# Altium project INDACT_baseboard.PrjPcb
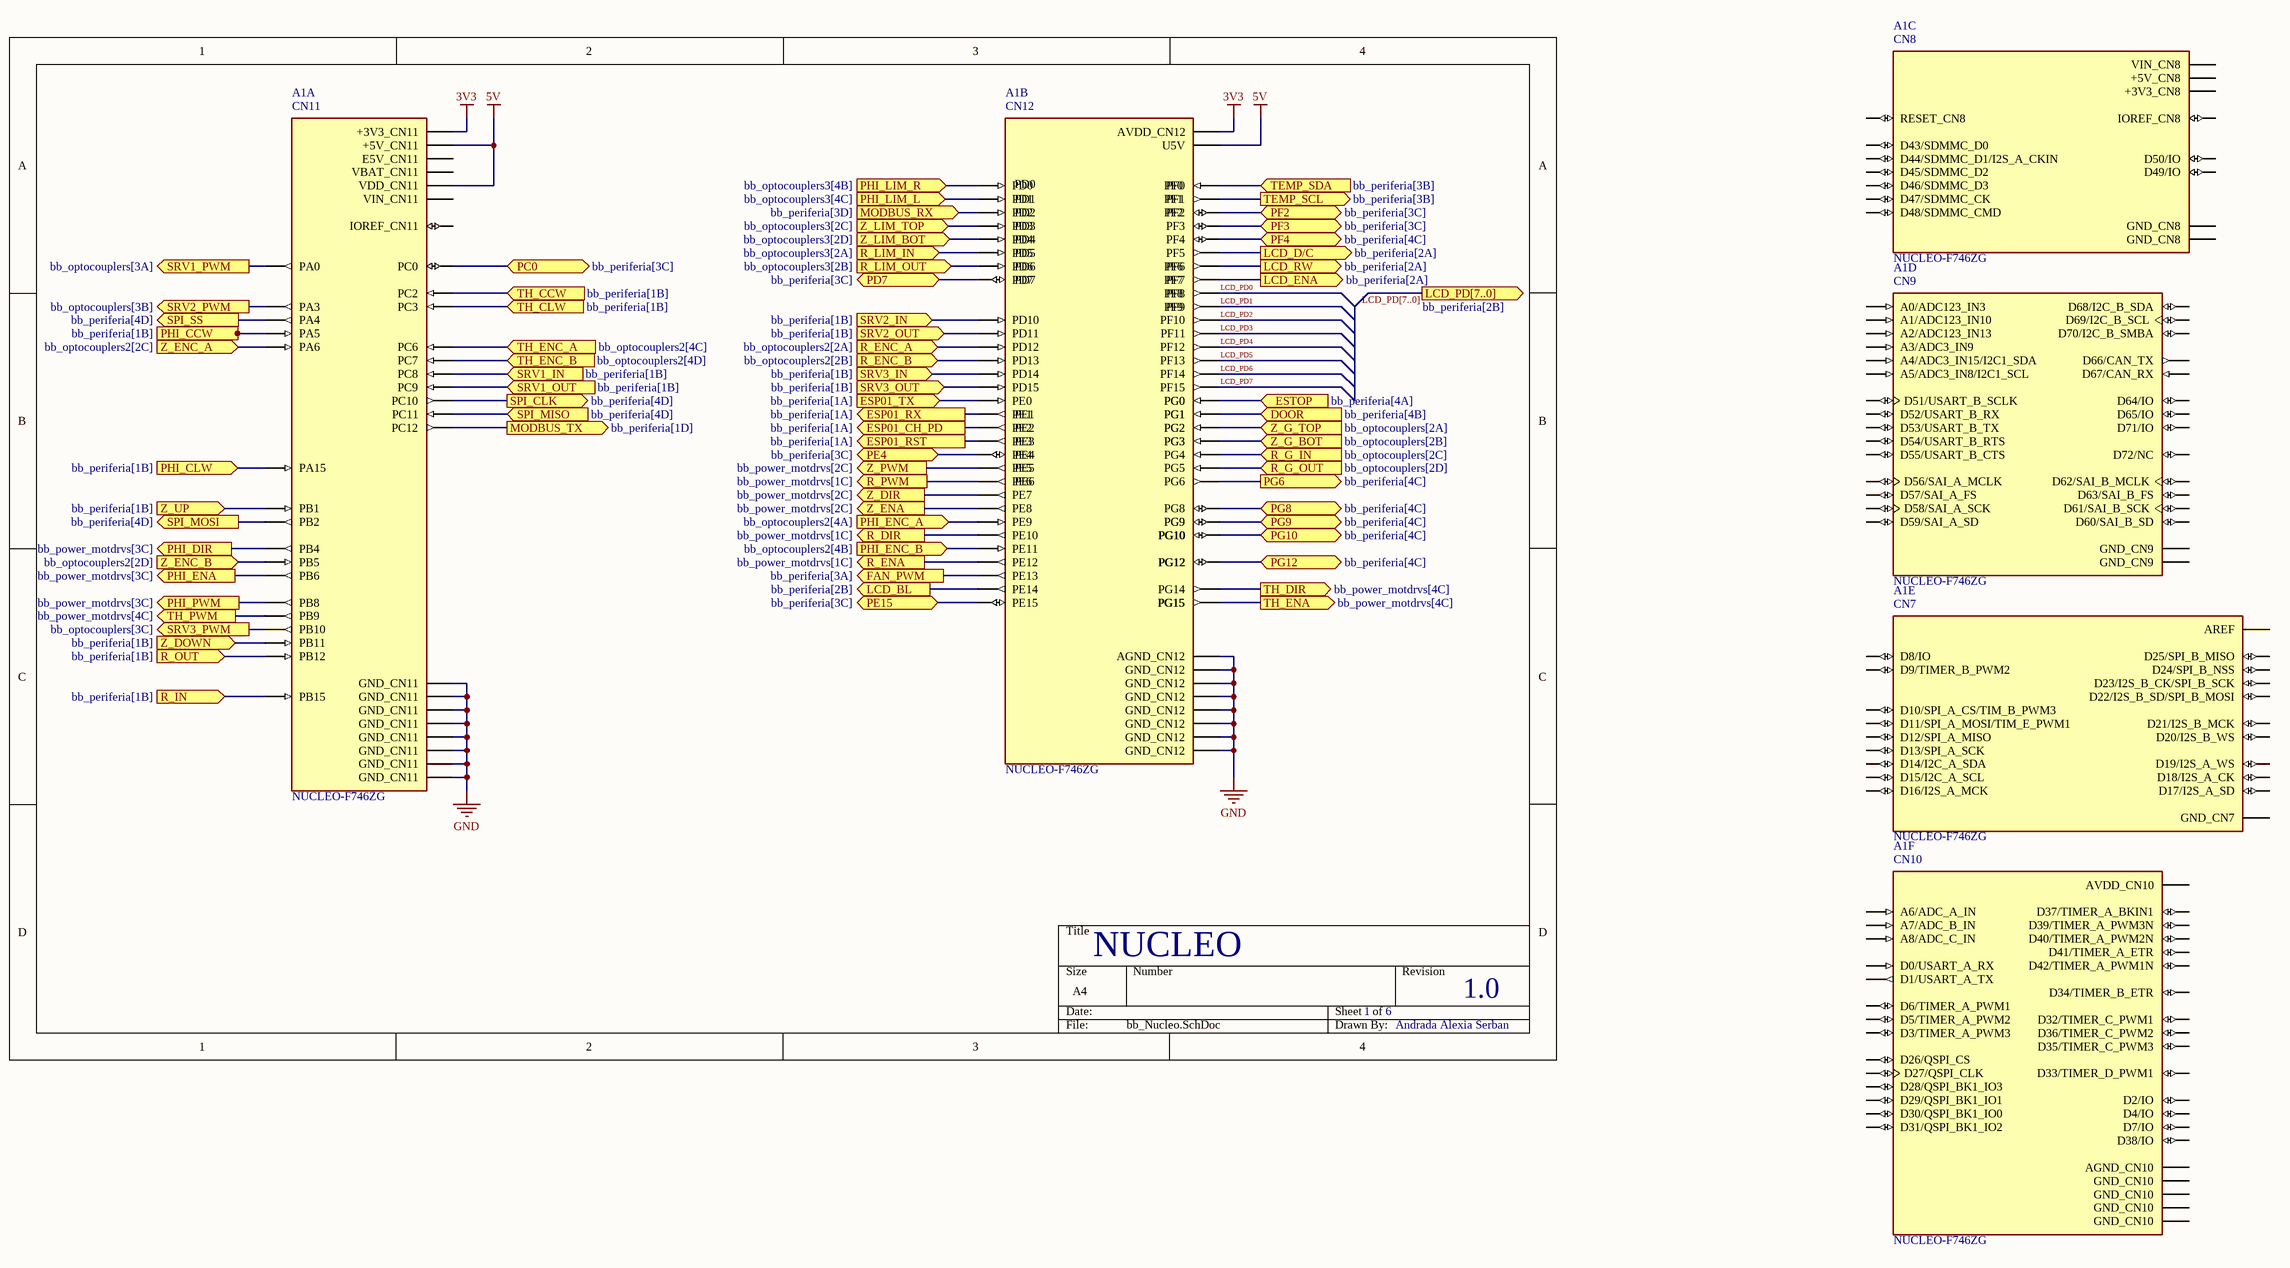
[diagram p0: bb_Nucleo.SchDoc]
6 sheets, 98 parts. Net scope: flat (ports and power ports of the same name join across sheets).
Sheets:
  bb_Nucleo.SchDoc
  bb_periferia.SchDoc
  bb_power_motdrvs.SchDoc
  bb_optocouplers.SchDoc
  bb_optocouplers2.SchDoc
  bb_optocouplers3.SchDoc

## Sheet bb_Nucleo.SchDoc
size A4; SheetNumber: 1; SheetTotal: 6

### Parts
A1  NUCLEO-F746ZG  [MODULE_NUCLEO-F746ZG]  (parts A,B,C,D,E,F of 6)

### Ports
DOOR (in, see bb_periferia[4B]), ESP01_CH_PD (out, see bb_periferia[1A]), ESP01_RST (out, see bb_periferia[1A]), ESP01_RX (out, see bb_periferia[1A]), ESP01_TX (in, see bb_periferia[1A]), ESTOP (in, see bb_periferia[4A]), FAN_PWM (out, see bb_periferia[3A]), LCD_BL (out, see bb_periferia[2B]), LCD_D/C (out, see bb_periferia[2A]), LCD_ENA (out, see bb_periferia[2A]), LCD_PD[7..0] (out, see bb_periferia[2B]), LCD_RW (out, see bb_periferia[2A]), MODBUS_RX (in, see bb_periferia[3D]), MODBUS_TX (out, see bb_periferia[1D]), PC0 (bidir, see bb_periferia[3C]), PD7 (bidir, see bb_periferia[3C]), PE4 (bidir, see bb_periferia[3C]), PE15 (bidir, see bb_periferia[3C]), PF2 (bidir, see bb_periferia[3C]), PF3 (bidir, see bb_periferia[3C]), PF4 (bidir, see bb_periferia[4C]), PG6 (out, see bb_periferia[4C]), PG8 (bidir, see bb_periferia[4C]), PG9 (bidir, see bb_periferia[4C]), PG10 (bidir, see bb_periferia[4C]), PG12 (bidir, see bb_periferia[4C]), PHI_CCW (in, see bb_periferia[1B]), PHI_CLW (in, see bb_periferia[1B]), PHI_DIR (out, see bb_power_motdrvs[3C]), PHI_ENA (out, see bb_power_motdrvs[3C]), PHI_ENC_A (in, see bb_optocouplers2[4A]), PHI_ENC_B (in, see bb_optocouplers2[4B]), PHI_LIM_L (in, see bb_optocouplers3[4C]), PHI_LIM_R (in, see bb_optocouplers3[4B]), PHI_PWM (out, see bb_power_motdrvs[3C]), R_DIR (out, see bb_power_motdrvs[1C]), R_ENA (out, see bb_power_motdrvs[1C]), R_ENC_A (in, see bb_optocouplers2[2A]), R_ENC_B (in, see bb_optocouplers2[2B]), R_G_IN (in, see bb_optocouplers[2C]), R_G_OUT (in, see bb_optocouplers[2D]), R_IN (in, see bb_periferia[1B]), R_LIM_IN (in, see bb_optocouplers3[2A]), R_LIM_OUT (in, see bb_optocouplers3[2B]), R_OUT (in, see bb_periferia[1B]), R_PWM (out, see bb_power_motdrvs[1C]), SPI_CLK (out, see bb_periferia[4D]), SPI_MISO (in, see bb_periferia[4D]), SPI_MOSI (out, see bb_periferia[4D]), SPI_SS (out, see bb_periferia[4D]), SRV1_IN (in, see bb_periferia[1B]), SRV1_OUT (in, see bb_periferia[1B]), SRV1_PWM (out, see bb_optocouplers[3A]), SRV2_IN (in, see bb_periferia[1B]), SRV2_OUT (in, see bb_periferia[1B]), SRV2_PWM (out, see bb_optocouplers[3B]), SRV3_IN (in, see bb_periferia[1B]), SRV3_OUT (in, see bb_periferia[1B]), SRV3_PWM (out, see bb_optocouplers[3C]), TEMP_SCL (out, see bb_periferia[3B]), TEMP_SDA (in, see bb_periferia[3B]), TH_CCW (in, see bb_periferia[1B]), TH_CLW (in, see bb_periferia[1B]), TH_DIR (out, see bb_power_motdrvs[4C]), TH_ENA (out, see bb_power_motdrvs[4C]), TH_ENC_A (in, see bb_optocouplers2[4C]), TH_ENC_B (in, see bb_optocouplers2[4D]), TH_PWM (out, see bb_power_motdrvs[4C]), Z_DIR (out, see bb_power_motdrvs[2C]), Z_DOWN (in, see bb_periferia[1B]), Z_ENA (out, see bb_power_motdrvs[2C]), Z_ENC_A (in, see bb_optocouplers2[2C]), Z_ENC_B (in, see bb_optocouplers2[2D]), Z_G_BOT (in, see bb_optocouplers[2B]), Z_G_TOP (in, see bb_optocouplers[2A]), Z_LIM_BOT (in, see bb_optocouplers3[2D]), Z_LIM_TOP (in, see bb_optocouplers3[2C]), Z_PWM (out, see bb_power_motdrvs[2C]), Z_UP (in, see bb_periferia[1B])

### Nets
3V3: A1.CN11_16(+3V3_CN11) A1.CN12_7(AVDD_CN12)
5V: A1.CN11_5(VDD_CN11) A1.CN11_18(+5V_CN11) A1.CN12_8(U5V)
GND: A1.CN11_8(GND_CN11) A1.CN11_19(GND_CN11) A1.CN11_20(GND_CN11) A1.CN11_22(GND_CN11) A1.CN11_49(GND_CN11) A1.CN11_60(GND_CN11) A1.CN11_71(GND_CN11) A1.CN11_72(GND_CN11) A1.CN12_9(GND_CN12) A1.CN12_20(GND_CN12) A1.CN12_32(AGND_CN12) A1.CN12_39(GND_CN12) A1.CN12_54(GND_CN12) A1.CN12_63(GND_CN12) A1.CN12_71(GND_CN12) A1.CN12_72(GND_CN12)
LCD_PD0: A1.CN11_54(PF8)
LCD_PD1: A1.CN11_56(PF9)
LCD_PD2: A1.CN12_42(PF10)
LCD_PD3: A1.CN12_62(PF11)
LCD_PD4: A1.CN12_59(PF12)
LCD_PD5: A1.CN12_57(PF13)
LCD_PD6: A1.CN12_50(PF14)
LCD_PD7: A1.CN12_60(PF15)
NetA1_CN11_1: A1.CN11_1(PC10) ; port SPI_CLK
NetA1_CN11_2: A1.CN11_2(PC11) ; port SPI_MISO
NetA1_CN11_3: A1.CN11_3(PC12) ; port MODBUS_TX
NetA1_CN11_4: A1.CN11_4(PD2) ; port MODBUS_RX
NetA1_CN11_9: A1.CN11_9(PF6) ; port LCD_RW
NetA1_CN11_11: A1.CN11_11(PF7) ; port LCD_ENA
NetA1_CN11_17: A1.CN11_17(PA15) ; port PHI_CLW
NetA1_CN11_28: A1.CN11_28(PA0) ; port SRV1_PWM
NetA1_CN11_32: A1.CN11_32(PA4) ; port SPI_SS
NetA1_CN11_35: A1.CN11_35(PC2) ; port TH_CCW
NetA1_CN11_37: A1.CN11_37(PC3) ; port TH_CLW
NetA1_CN11_38: A1.CN11_38(PC0) ; port PC0
NetA1_CN11_39: A1.CN11_39(PD4) ; port Z_LIM_BOT
NetA1_CN11_40: A1.CN11_40(PD3) ; port Z_LIM_TOP
NetA1_CN11_41: A1.CN11_41(PD5) ; port R_LIM_IN
NetA1_CN11_42: A1.CN11_42(PG2) ; port Z_G_TOP
NetA1_CN11_43: A1.CN11_43(PD6) ; port R_LIM_OUT
NetA1_CN11_44: A1.CN11_44(PG3) ; port Z_G_BOT
NetA1_CN11_45: A1.CN11_45(PD7) ; port PD7
NetA1_CN11_46: A1.CN11_46(PE2) ; port ESP01_CH_PD
NetA1_CN11_47: A1.CN11_47(PE3) ; port ESP01_RST
NetA1_CN11_48: A1.CN11_48(PE4) ; port PE4
NetA1_CN11_50: A1.CN11_50(PE5) ; port Z_PWM
NetA1_CN11_51: A1.CN11_51(PF1) ; port TEMP_SCL
NetA1_CN11_52: A1.CN11_52(PF2) ; port PF2
NetA1_CN11_53: A1.CN11_53(PF0) ; port TEMP_SDA
NetA1_CN11_55: A1.CN11_55(PD1) ; port PHI_LIM_L
NetA1_CN11_57: A1.CN11_57(PD0) ; port PHI_LIM_R
NetA1_CN11_58: A1.CN11_58(PG1) ; port DOOR
NetA1_CN11_59: A1.CN11_59(PG0) ; port ESTOP
NetA1_CN11_61: A1.CN11_61(PE1) ; port ESP01_RX
NetA1_CN11_62: A1.CN11_62(PE6) ; port R_PWM
NetA1_CN11_63: A1.CN11_63(PG9) ; port PG9
NetA1_CN11_64: A1.CN11_64(PG15) ; port TH_ENA
NetA1_CN11_65: A1.CN11_65(PG12) ; port PG12
NetA1_CN11_66: A1.CN11_66(PG10) ; port PG10
NetA1_CN12_1: A1.CN12_1(PC9) ; port SRV1_OUT
NetA1_CN12_2: A1.CN12_2(PC8) ; port SRV1_IN
NetA1_CN12_3: A1.CN12_3(PB8) ; port PHI_PWM
NetA1_CN12_4: A1.CN12_4(PC6) ; port TH_ENC_A
NetA1_CN12_5: A1.CN12_5(PB9) ; port TH_PWM
NetA1_CN12_11: A1.CN12_11(PA5) ; port PHI_CCW
NetA1_CN12_13: A1.CN12_13(PA6) ; port Z_ENC_A
NetA1_CN12_16: A1.CN12_16(PB12) ; port R_OUT
NetA1_CN12_17: A1.CN12_17(PB6) ; port PHI_ENA
NetA1_CN12_18: A1.CN12_18(PB11) ; port Z_DOWN
NetA1_CN12_19: A1.CN12_19(PC7) ; port TH_ENC_B
NetA1_CN12_22: A1.CN12_22(PB2) ; port SPI_MOSI
NetA1_CN12_24: A1.CN12_24(PB1) ; port Z_UP
NetA1_CN12_25: A1.CN12_25(PB10) ; port SRV3_PWM
NetA1_CN12_26: A1.CN12_26(PB15) ; port R_IN
NetA1_CN12_27: A1.CN12_27(PB4) ; port PHI_DIR
NetA1_CN12_29: A1.CN12_29(PB5) ; port Z_ENC_B
NetA1_CN12_36: A1.CN12_36(PF5) ; port LCD_D/C
NetA1_CN12_37: A1.CN12_37(PA3) ; port SRV2_PWM
NetA1_CN12_38: A1.CN12_38(PF4) ; port PF4
NetA1_CN12_40: A1.CN12_40(PE8) ; port Z_ENA
NetA1_CN12_41: A1.CN12_41(PD13) ; port R_ENC_B
NetA1_CN12_43: A1.CN12_43(PD12) ; port R_ENC_A
NetA1_CN12_44: A1.CN12_44(PE7) ; port Z_DIR
NetA1_CN12_45: A1.CN12_45(PD11) ; port SRV2_OUT
NetA1_CN12_46: A1.CN12_46(PD14) ; port SRV3_IN
NetA1_CN12_47: A1.CN12_47(PE10) ; port R_DIR
NetA1_CN12_48: A1.CN12_48(PD15) ; port SRV3_OUT
NetA1_CN12_49: A1.CN12_49(PE12) ; port R_ENA
NetA1_CN12_51: A1.CN12_51(PE14) ; port LCD_BL
NetA1_CN12_52: A1.CN12_52(PE9) ; port PHI_ENC_A
NetA1_CN12_53: A1.CN12_53(PE15) ; port PE15
NetA1_CN12_55: A1.CN12_55(PE13) ; port FAN_PWM
NetA1_CN12_56: A1.CN12_56(PE11) ; port PHI_ENC_B
NetA1_CN12_58: A1.CN12_58(PF3) ; port PF3
NetA1_CN12_61: A1.CN12_61(PG14) ; port TH_DIR
NetA1_CN12_64: A1.CN12_64(PE0) ; port ESP01_TX
NetA1_CN12_65: A1.CN12_65(PD10) ; port SRV2_IN
NetA1_CN12_66: A1.CN12_66(PG8) ; port PG8
NetA1_CN12_68: A1.CN12_68(PG5) ; port R_G_OUT
NetA1_CN12_69: A1.CN12_69(PG4) ; port R_G_IN
NetA1_CN12_70: A1.CN12_70(PG6) ; port PG6

Not connected (* = marked no-connect by the designer): A1 CN7_1(D16/I2S_A_MCK) CN7_2(D15/I2C_A_SCL) CN7_3(D17/I2S_A_SD) CN7_4(D14/I2C_A_SDA) CN7_5(D18/I2S_A_CK) CN7_6(AREF) CN7_7(D19/I2S_A_WS) CN7_8(GND_CN7) CN7_9(D20/I2S_B_WS) CN7_10(D13/SPI_A_SCK) CN7_11(D21/I2S_B_MCK) CN7_12(D12/SPI_A_MISO) CN7_13(D22/I2S_B_SD/SPI_B_MOSI) CN7_14(D11/SPI_A_MOSI/TIM_E_PWM1) CN7_15(D23/I2S_B_CK/SPI_B_SCK) CN7_16(D10/SPI_A_CS/TIM_B_PWM3) CN7_17(D24/SPI_B_NSS) CN7_18(D9/TIMER_B_PWM2) CN7_19(D25/SPI_B_MISO) CN7_20(D8/IO) CN8_2(D43/SDMMC_D0) CN8_3(IOREF_CN8) CN8_4(D44/SDMMC_D1/I2S_A_CKIN) CN8_5(RESET_CN8) CN8_6(D45/SDMMC_D2) CN8_7(+3V3_CN8) CN8_8(D46/SDMMC_D3) CN8_9(+5V_CN8) CN8_10(D47/SDMMC_CK) CN8_11(GND_CN8) CN8_12(D48/SDMMC_CMD) CN8_13(GND_CN8) CN8_14(D49/IO) CN8_15(VIN_CN8) CN8_16(D50/IO) CN9_1(A0/ADC123_IN3) CN9_2(D51/USART_B_SCLK) CN9_3(A1/ADC123_IN10) CN9_4(D52/USART_B_RX) CN9_5(A2/ADC123_IN13) CN9_6(D53/USART_B_TX) CN9_7(A3/ADC3_IN9) CN9_8(D54/USART_B_RTS) CN9_9(A4/ADC3_IN15/I2C1_SDA) CN9_10(D55/USART_B_CTS) CN9_11(A5/ADC3_IN8/I2C1_SCL) CN9_12(GND_CN9) CN9_13(D72/NC) CN9_14(D56/SAI_A_MCLK) CN9_15(D71/IO) CN9_16(D57/SAI_A_FS) CN9_17(D70/I2C_B_SMBA) CN9_18(D58/SAI_A_SCK) CN9_19(D69/I2C_B_SCL) CN9_20(D59/SAI_A_SD) CN9_21(D68/I2C_B_SDA) CN9_22(D60/SAI_B_SD) CN9_23(GND_CN9) CN9_24(D61/SAI_B_SCK) CN9_25(D67/CAN_RX) CN9_26(D62/SAI_B_MCLK) CN9_27(D66/CAN_TX) CN9_28(D63/SAI_B_FS) CN9_29(D65/IO) CN9_30(D64/IO) CN10_1(AVDD_CN10) CN10_2(D7/IO) CN10_3(AGND_CN10) CN10_4(D6/TIMER_A_PWM1) CN10_5(GND_CN10) CN10_6(D5/TIMER_A_PWM2) CN10_7(A6/ADC_A_IN) CN10_8(D4/IO) CN10_9(A7/ADC_B_IN) CN10_10(D3/TIMER_A_PWM3) CN10_11(A8/ADC_C_IN) CN10_12(D2/IO) CN10_13(D26/QSPI_CS) CN10_14(D1/USART_A_TX) CN10_15(D27/QSPI_CLK) CN10_16(D0/USART_A_RX) CN10_17(GND_CN10) CN10_18(D42/TIMER_A_PWM1N) CN10_19(D28/QSPI_BK1_IO3) CN10_20(D41/TIMER_A_ETR) CN10_21(D29/QSPI_BK1_IO1) CN10_22(GND_CN10) CN10_23(D30/QSPI_BK1_IO0) CN10_24(D40/TIMER_A_PWM2N) CN10_25(D31/QSPI_BK1_IO2) CN10_26(D39/TIMER_A_PWM3N) CN10_27(GND_CN10) CN10_28(D38/IO) CN10_29(D32/TIMER_C_PWM1) CN10_30(D37/TIMER_A_BKIN1) CN10_31(D33/TIMER_D_PWM1) CN10_32(D36/TIMER_C_PWM2) CN10_33(D34/TIMER_B_ETR) CN10_34(D35/TIMER_C_PWM3) CN11_6(E5V_CN11) CN11_7(BOOT0) CN11_12(IOREF_CN11) CN11_13(PA13) CN11_14(RESET_CN11) CN11_15(PA14) CN11_21(PB7) CN11_23(PC13) CN11_24(VIN_CN11) CN11_25(PC14) CN11_27(PC15) CN11_29(PH0) CN11_30(PA1) CN11_31(PH1) CN11_33(VBAT_CN11) CN11_34(PB0) CN11_36(PC1) CN11_68(PG13) CN11_69(PD9) CN11_70(PG11) CN12_6(PC5) CN12_10(PD8) CN12_12(PA12) CN12_14(PA11) CN12_15(PA7) CN12_21(PA9) CN12_23(PA8) CN12_28(PB14) CN12_30(PB13) CN12_31(PB3) CN12_33(PA10) CN12_34(PC4) CN12_35(PA2) CN12_67(PG7)

### Buses and harness runs
bus LCD_PD[7..0]

### Notes on the sheet
- (near A1) PD0
- (near A1) PD1
- (near A1) PD2
- (near A1) PF0
- (near A1) PF1
- (near A1) PF2
- (near A1) PD3
- (near A1) PD4
- (near A1) PD5
- (near A1) PD6
- (near A1) PD7
- (near A1) PF6
- (near A1) PF7
- (near A1) PF8
- (near A1) PF9
- (near A1) PE1
- (near A1) PG0
- (near A1) PG1
- (near A1) PE2
- (near A1) PE3
- (near A1) PE4
- (near A1) PE5
- (near A1) PE6
- (near A1) PG2
- (near A1) PG3
- (near A1) PG10
- (near A1) PG9
- (near A1) PG15
- (near A1) PG12
- NUCLEO
- 1
- 6
- 1.0
- Andrada Alexia Serban
- Labels drawn without touching a wire or pin: LCD_PD[7..0]
- (in symbol CMP-015-000000-1, part A) CN11
- (in symbol CMP-015-000000-1, part B) CN12
- (in symbol CMP-015-000000-1, part C) CN8
- (in symbol CMP-015-000000-1, part D) CN9
- (in symbol CMP-015-000000-1, part E) CN7
- (in symbol CMP-015-000000-1, part F) CN10

### Library data of the parts
A1 = CMP-015-000000-1: STM32F746ZG, mbed-Enabled Development Nucleo-144 STM32F7 ARMÂ® CortexÂ®-M7 MCU 32-Bit Embedded Evaluation Board; MF: STMicroelectronics; Purchase-URL: https://pricing.snapeda.com/search/part/NUCLEO-F746ZG/?ref=eda; MP: NUCLEO-F746ZG; Design Item ID: NUCLEO-F746ZG; Pin Count: 240; Component Type: Standard; SnapEDA_Link: https://www.snapeda.com/parts/NUCLEO-F746ZG/STMicroelectronics/view-part/531935/?ref=snap; Source: NUCLEO-F746ZG.SchLib; Check_prices: https://www.snapeda.com/parts/NUCLEO-F746ZG/STMicroelectronics/view-part/531935/?ref=eda; Package: None; Price: None; Value: *; Availability: Warning

## Sheet bb_periferia.SchDoc
size A4; SheetNumber: 2; SheetTotal: 6
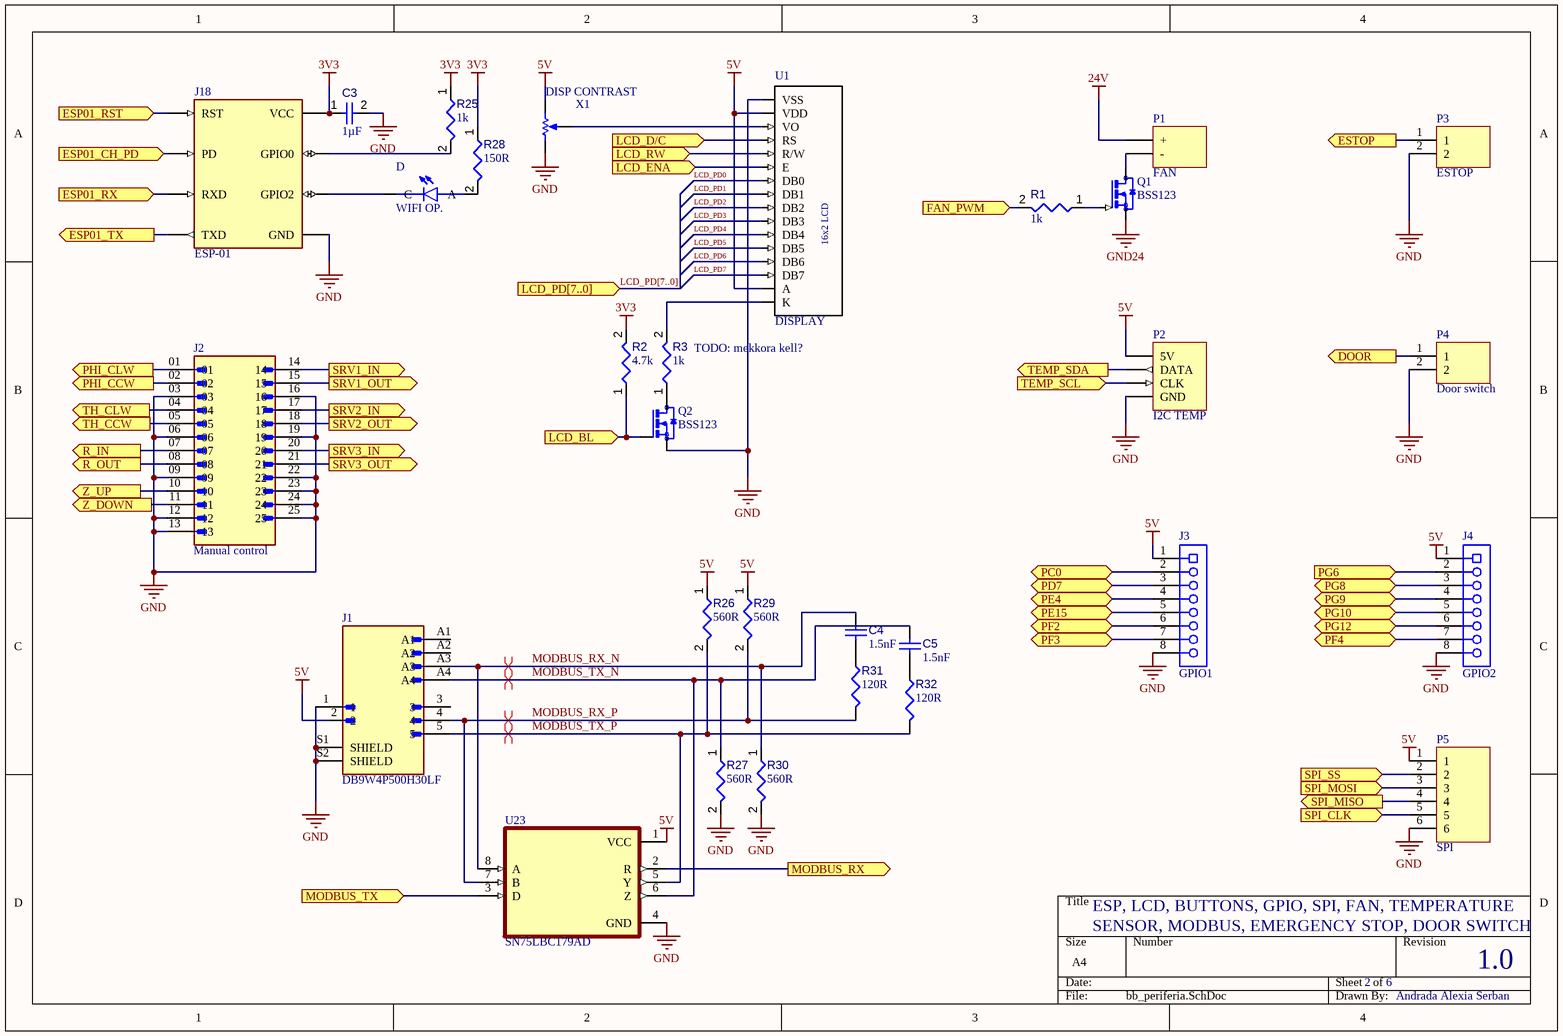
[diagram p1: bb_periferia.SchDoc]

### Parts
C3  value 1µF  [CAPC2013X145X50ML20T25]  (hidden comment: Capacitor 1 uF +/- 10% 25 V 0805)
C4  value 1.5nF  [CAPC2013X145X50ML20T25]  (hidden comment: Capacitor 1 uF +/- 10% 25 V 0805)
C5  value 1.5nF  [CAPC2013X145X50ML20T25]  (hidden comment: Capacitor 1 uF +/- 10% 25 V 0805)
D  WIFI OP.  [LEDC2012X70N]
J1  DB9W4P500H30LF  [AMPHENOL_DB9W4P500H30LF]
J2  Manual control  [AMPHENOL_DB25P564CTXLF]
J3  GPIO1  [SLIN-PPPC081LFBN-RC_V]
J4  GPIO2  [SLIN-PPPC081LFBN-RC_V]
J18  ESP-01  [ESP-01]
P1  FAN  [FP_CONN2_TAP_254MM]
P2  I2C TEMP  [FP_CONN4_TAP_254MM]
P3  ESTOP  [FP_CONN2_TAP_254MM]
P4  Door switch  [FP_CONN2_TAP_254MM]
P5  SPI  [FP_CONN6_TAP_254MM]
Q1  BSS123  [SOT23]
Q2  BSS123  [SOT23]
R1  value 1k  [RESC0402(1005)_L]  (hidden comment: Resistor 200R +/-5 % 0402 63 mW)
R2  value 4.7k  [RESC2013X70X40ML20T20]  (hidden comment: Resistor 4k7 +/-1% 0805 125 mW)
R3  value 1k  [RESC0805(2012)_L]  (hidden comment: 1KR5J)
R25  value 1k  [RESC0402(1005)_L]  (hidden comment: Resistor 200R +/-5 % 0402 63 mW)
R26  value 560R  [RESC0402(1005)_L]  (hidden comment: Resistor 200R +/-5 % 0402 63 mW)
R27  value 560R  [RESC0402(1005)_L]  (hidden comment: Resistor 200R +/-5 % 0402 63 mW)
R28  value 150R  [RESC0402(1005)_L]  (hidden comment: Resistor 200R +/-5 % 0402 63 mW)
R29  value 560R  [RESC0402(1005)_L]  (hidden comment: Resistor 200R +/-5 % 0402 63 mW)
R30  value 560R  [RESC0402(1005)_L]  (hidden comment: Resistor 200R +/-5 % 0402 63 mW)
R31  value 120R  [RESC0402(1005)_L]  (hidden comment: Resistor 200R +/-5 % 0402 63 mW)
R32  value 120R  [RESC0402(1005)_L]  (hidden comment: Resistor 200R +/-5 % 0402 63 mW)
U1  DISPLAY  [*LCD-16X2]
U23  SN75LBC179AD  [SOIC127P599X175-8N]
X1  DISP CONTRAST

### Ports
DOOR (out, see bb_Nucleo[4B]), ESP01_CH_PD (in, see bb_Nucleo[3B]), ESP01_RST (in, see bb_Nucleo[3B]), ESP01_RX (in, see bb_Nucleo[3B]), ESP01_TX (out, see bb_Nucleo[3B]), ESTOP (out, see bb_Nucleo[4B]), FAN_PWM (in, see bb_Nucleo[3C]), LCD_BL (in, see bb_Nucleo[3C]), LCD_D/C (in, see bb_Nucleo[4A]), LCD_ENA (in, see bb_Nucleo[4A]), LCD_PD[7..0] (in, see bb_Nucleo[4B]), LCD_RW (in, see bb_Nucleo[4A]), MODBUS_RX (out, see bb_Nucleo[3A]), MODBUS_TX (in, see bb_Nucleo[2B]), PC0 (bidir, see bb_Nucleo[2A]), PD7 (bidir, see bb_Nucleo[3A]), PE4 (bidir, see bb_Nucleo[3B]), PE15 (bidir, see bb_Nucleo[3C]), PF2 (bidir, see bb_Nucleo[4A]), PF3 (bidir, see bb_Nucleo[4A]), PF4 (bidir, see bb_Nucleo[4A]), PG6 (in, see bb_Nucleo[4B]), PG8 (bidir, see bb_Nucleo[4B]), PG9 (bidir, see bb_Nucleo[4B]), PG10 (bidir, see bb_Nucleo[4B]), PG12 (bidir, see bb_Nucleo[4C]), PHI_CCW (out, see bb_Nucleo[1B]), PHI_CLW (out, see bb_Nucleo[1B]), R_IN (out, see bb_Nucleo[1C]), R_OUT (out, see bb_Nucleo[1C]), SPI_CLK (in, see bb_Nucleo[2B]), SPI_MISO (out, see bb_Nucleo[2B]), SPI_MOSI (in, see bb_Nucleo[1B]), SPI_SS (in, see bb_Nucleo[1B]), SRV1_IN (out, see bb_Nucleo[2B]), SRV1_OUT (out, see bb_Nucleo[2B]), SRV2_IN (out, see bb_Nucleo[3B]), SRV2_OUT (out, see bb_Nucleo[3B]), SRV3_IN (out, see bb_Nucleo[3B]), SRV3_OUT (out, see bb_Nucleo[3B]), TEMP_SCL (in, see bb_Nucleo[4A]), TEMP_SDA (out, see bb_Nucleo[4A]), TH_CCW (out, see bb_Nucleo[2B]), TH_CLW (out, see bb_Nucleo[2B]), Z_DOWN (out, see bb_Nucleo[1C]), Z_UP (out, see bb_Nucleo[1B])

### Nets
3V3: C3.1 J18.7(VCC) R2.2 R25.1 R28.1
5V: J1.2 J3.1 J4.1 P2.1(5V) P5.1 R26.1 R29.1 U1.2(VDD) U1.15(A) U23.1(VCC) X1.2(BOT)
24V: P1.1(+)
GND: C3.2 J1.1 J1.S1(SHIELD) J1.S2(SHIELD) J2.03 J2.06 J2.09 J2.12 J2.13 J2.16 J2.19 J2.22 J2.23 J2.24 J2.25 J3.8 J4.8 J18.2(GND) P2.4(GND) P3.2 P4.2 P5.6 Q2.2(S) R27.2 R30.2 U1.1(VSS) U23.4(GND) X1.1(TOP)
GND24: Q1.2(S)
LCD_PD0: U1.7(DB0)
LCD_PD1: U1.8(DB1)
LCD_PD2: U1.9(DB2)
LCD_PD3: U1.10(DB3)
LCD_PD4: U1.11(DB4)
LCD_PD5: U1.12(DB5)
LCD_PD6: U1.13(DB6)
LCD_PD7: U1.14(DB7)
MODBUS_RX_N: C4.2 J1.A3 R30.1 U23.8(A)
MODBUS_RX_P: J1.4 R29.2 R31.2 U23.7(B)
MODBUS_TX_N: C5.2 J1.A4 R27.1 U23.6(Z)
MODBUS_TX_P: J1.5 R26.2 R32.2 U23.5(Y)
NetA1_CN11_1: P5.5 ; port SPI_CLK
NetA1_CN11_2: P5.4 ; port SPI_MISO
NetA1_CN11_3: U23.3(D) ; port MODBUS_TX
NetA1_CN11_4: U23.2(R) ; port MODBUS_RX
NetA1_CN11_9: U1.5(R/W) ; port LCD_RW
NetA1_CN11_11: U1.6(E) ; port LCD_ENA
NetA1_CN11_17: J2.01 ; port PHI_CLW
NetA1_CN11_32: P5.2 ; port SPI_SS
NetA1_CN11_35: J2.05 ; port TH_CCW
NetA1_CN11_37: J2.04 ; port TH_CLW
NetA1_CN11_38: J3.2 ; port PC0
NetA1_CN11_45: J3.3 ; port PD7
NetA1_CN11_46: J18.3(PD) ; port ESP01_CH_PD
NetA1_CN11_47: J18.5(RST) ; port ESP01_RST
NetA1_CN11_48: J3.4 ; port PE4
NetA1_CN11_51: P2.3(CLK) ; port TEMP_SCL
NetA1_CN11_52: J3.6 ; port PF2
NetA1_CN11_53: P2.2(DATA) ; port TEMP_SDA
NetA1_CN11_58: P4.1 ; port DOOR
NetA1_CN11_59: P3.1 ; port ESTOP
NetA1_CN11_61: J18.8(RXD) ; port ESP01_RX
NetA1_CN11_63: J4.4 ; port PG9
NetA1_CN11_65: J4.6 ; port PG12
NetA1_CN11_66: J4.5 ; port PG10
NetA1_CN12_1: J2.15 ; port SRV1_OUT
NetA1_CN12_2: J2.14 ; port SRV1_IN
NetA1_CN12_11: J2.02 ; port PHI_CCW
NetA1_CN12_16: J2.08 ; port R_OUT
NetA1_CN12_18: J2.11 ; port Z_DOWN
NetA1_CN12_22: P5.3 ; port SPI_MOSI
NetA1_CN12_24: J2.10 ; port Z_UP
NetA1_CN12_26: J2.07 ; port R_IN
NetA1_CN12_36: U1.4(RS) ; port LCD_D/C
NetA1_CN12_38: J4.7 ; port PF4
NetA1_CN12_45: J2.18 ; port SRV2_OUT
NetA1_CN12_46: J2.20 ; port SRV3_IN
NetA1_CN12_48: J2.21 ; port SRV3_OUT
NetA1_CN12_51: Q2.1(G) R2.1 ; port LCD_BL
NetA1_CN12_53: J3.5 ; port PE15
NetA1_CN12_55: R1.2 ; port FAN_PWM
NetA1_CN12_58: J3.7 ; port PF3
NetA1_CN12_64: J18.1(TXD) ; port ESP01_TX
NetA1_CN12_65: J2.17 ; port SRV2_IN
NetA1_CN12_66: J4.3 ; port PG8
NetA1_CN12_70: J4.2 ; port PG6
NetC4_1: C4.1 R31.1
NetC5_1: C5.1 R32.1
NetD_A: D.A R28.2
NetD_C: D.C J18.4(GPIO2)
NetJ18_6: J18.6(GPIO0) R25.2
NetP1_2: P1.2(-) Q1.3(D)
NetQ1_1: Q1.1(G) R1.1
NetQ2_3: Q2.3(D) R3.1
NetR3_2: R3.2 U1.16(K)
NetU1_3: U1.3(VO) X1.3(TAP)

Not connected (* = marked no-connect by the designer): J1 3 A1 A2

### Buses and harness runs
bus LCD_PD[7..0] = port LCD_PD[7..0]

### Layout directives
differential pair: MODBUS_RX_N, MODBUS_RX_P, MODBUS_TX_N, MODBUS_TX_P

### Notes on the sheet
- TODO: mekkora kell?
- ESP, LCD, BUTTONS, GPIO, SPI, FAN, TEMPERATURE
- SENSOR, MODBUS, EMERGENCY STOP, DOOR SWITCH
- 2
- 6
- 1.0
- Andrada Alexia Serban
- (in symbol LCD-16X2) 16x2 LCD

### Library data of the parts
C3-C5 = CMP-001-00010-6: Chip Capacitor, 1 uF, +/-10%, 25 V, 0805 (2012 Metric); Capacitor Type: Ceramic; Voltage Rating: 25V; RoHS Compliant: True; Pins: 2; Mounting Technology: SM; Max Operating Temperature: 125°C; Min Operating Temperature: -55°C; Tolerance: 10%; Case/Package: 0805
D = CMP-023-000000-1: Blue 473nm LED Indication - Discrete 3.2V 0805 _2012 Metric_; MF: Dialight; MP: 598-8191-107F; Price: None; Availability: Unavailable; Package: 0805 Dialight; Component Type: Standard; Design Item ID: 598-8191-107F; Source: SnapEDAsch.SchLib; SnapEDA_Link: https://www.snapeda.com/parts/598-8191-107F/Dialight/view-part/432480/?ref=snap; Value: *; Pin Count: 2
J1 = CMP-034-000000-1: D-Sub Power Board Mount Connectors, Input Output Connectors, Mixed Signal and Power 9W4 Pin Right Angle Solder 30A, Europe Standard, 200 Cycles, Front: Without Accessory, Back: Harpoons for 2.4mm PCB Thickness.; MF: Amphenol FCI; Check_prices: https://www.snapeda.com/parts/DB9W4P500H30LF/Amphenol/view-part/?ref=eda; Availability: Not in stock; Pin Count: 11; SnapEDA_Link: https://www.snapeda.com/parts/DB9W4P500H30LF/Amphenol/view-part/?ref=snap; MP: DB9W4P500H30LF; Component Type: Standard; Design Item ID: DB9W4P500H30LF; Source: DB9W4P500H30LF.SchLib; Package: None; Price: None; Value: *
J2 = CMP-028-000000-1: DB25P564CTXLF-DSUB R/A STB 25PIN LF; MF: Amphenol ICC (FCI); Package: None; Design Item ID: DB25P564CTXLF; Value: *; Check_prices: https://www.snapeda.com/parts/DB25P564CTXLF/Amphenol+FCI/view-part/?ref=eda; Source: DB25P564CTXLF.SchLib; Pin Count: 25; Digi-Key_Part_Number: DB25P564CTXLF-ND; MP: DB25P564CTXLF; Component Type: Standard; SnapEDA_Link: https://www.snapeda.com/parts/DB25P564CTXLF/Amphenol+FCI/view-part/?ref=snap; Purchase-URL: https://pricing.snapeda.com/search/part/DB25P564CTXLF/?ref=eda
J3 J4 = CMP-002-00028-2: Female Header, Pitch 2.54 mm, 1 x 8 Position, Height 8.5 mm, Tail Length 3.2 mm, -40 to 105 degC, RoHS, Bulk; Manufacturer: Sullins; Package Reference: PPPC081LFBN-RC; Connector Type: Header; Datasheet Version: Jan-15; Package Description: Female Header, Pitch 2.54 mm, 1 x 8 Position, Height 8.5 mm, Tail Length 3.2 mm; RoHS Compliant: Unknown; Max Operating Temperature: 105°C; Case/Package: PPPC081LFBN-RC; Min Operating Temperature: -40°C; Datasheet URL: http://sullinscorp.com/catalogs/101_PAGE114-115_.100_FEMALE_HDR.pdf; Gender: Female; Mounting Technology: TH
J18 = CMP-017-000000-1: ESP-01M ESP8266 DIP Adapter series Transceiver; 802.11 b/g/n (Wi-Fi, WiFi, WLAN) Evaluation Board; MF: AI-Thinker; Availability: Not in stock; Package: Non-Standard AI-Thinker; MP: ESP-01; Value: *; SnapEDA_Link: https://www.snapeda.com/parts/ESP-01/AI-Thinker/view-part/?ref=snap; Price: None; Check_prices: https://www.snapeda.com/parts/ESP-01/AI-Thinker/view-part/?ref=eda; Design Item ID: ESP-01; Component Type: Standard; Source: ESP-01.SchLib; Pin Count: 8
P1 P3 P4 = Connector_2pin: 2pin connector
P2 = Connector_4pin: 4pin Connector
P5 = Connector_6pin: 6pin connector
Q1 Q2 = CMP-021-000000-1: N-Channel 100V 170mA _Ta_ 360mW _Ta_ Surface Mount SOT-23-3; MF: ON Semiconductor; Design Item ID: BSS123; Source: SnapEDAsch.SchLib; Package: SOT-23 ON Semiconductor; Value: *; SnapEDA_Link: https://www.snapeda.com/parts/BSS123/ON%20Semiconductor/view-part/2489351/?ref=snap; Availability: Unavailable; Price: None; Component Type: Standard; MP: BSS123; Pin Count: 3
R1 R25-R32 = CMP-009-00161-3: Chip Resistor, 200 Ohms, +/-5 %, 63 mW, -55 to 155 degC, 0402; Power: 63mW; Tolerance: 5%; Min Operating Temperature: -55°C; Case/Package: 0402; Max Operating Temperature: 155°C; Pins: 2
R2 = CMP-009-00032-5: Chip Resistor, 4.7 KOhm, +/- 1%, 0.125 W, -55 to 155 degC, 0805 (2012 Metric); Power: 125mW; Voltage Rating: 150V; Max Operating Temperature: 155°C; Min Operating Temperature: -55°C; Case/Package: 0805; RoHS Compliant: True; Pins: 2; Tolerance: 1%; Mounting Technology: SM
R3 = CMP-009-00076-2: 1K 0.125W 5% 0805 (2012 Metric)  SMD; Power: 125mW; Pins: 2; Mounting Technology: SMT; Tolerance: 5%; Case/Package: 0805
U1 = LCD-16X2: Display Development Tools 16x2 Black on Green Char LCD w Backlight; MF: Gravitech; Availability: In Stock; Package: None; MP: LCD-16X2; SnapEDA_Link: https://www.snapeda.com/parts/LCD-16X2/Gravitech/view-part/?ref=snap; Price: None; Purchase-URL: https://pricing.snapeda.com/search/part/LCD-16X2/?ref=eda; Check_prices: https://www.snapeda.com/parts/LCD-16X2/Gravitech/view-part/?ref=eda; Value: *
U23 = CMP-032-000000-1: Design Item ID: SN75LBC179AD; Availability: Unavailable; Package: None; Price: None; MP: SN75LBC179AD; Pin Count: 8; Component Type: Standard; Value: *; Source: SN75LBC179AD.SchLib
X1 = Potentiometer: value: 1k; position: 0.5; SimulationGenericComponent: True

## Sheet bb_power_motdrvs.SchDoc
size A4; SheetNumber: 3; SheetTotal: 6
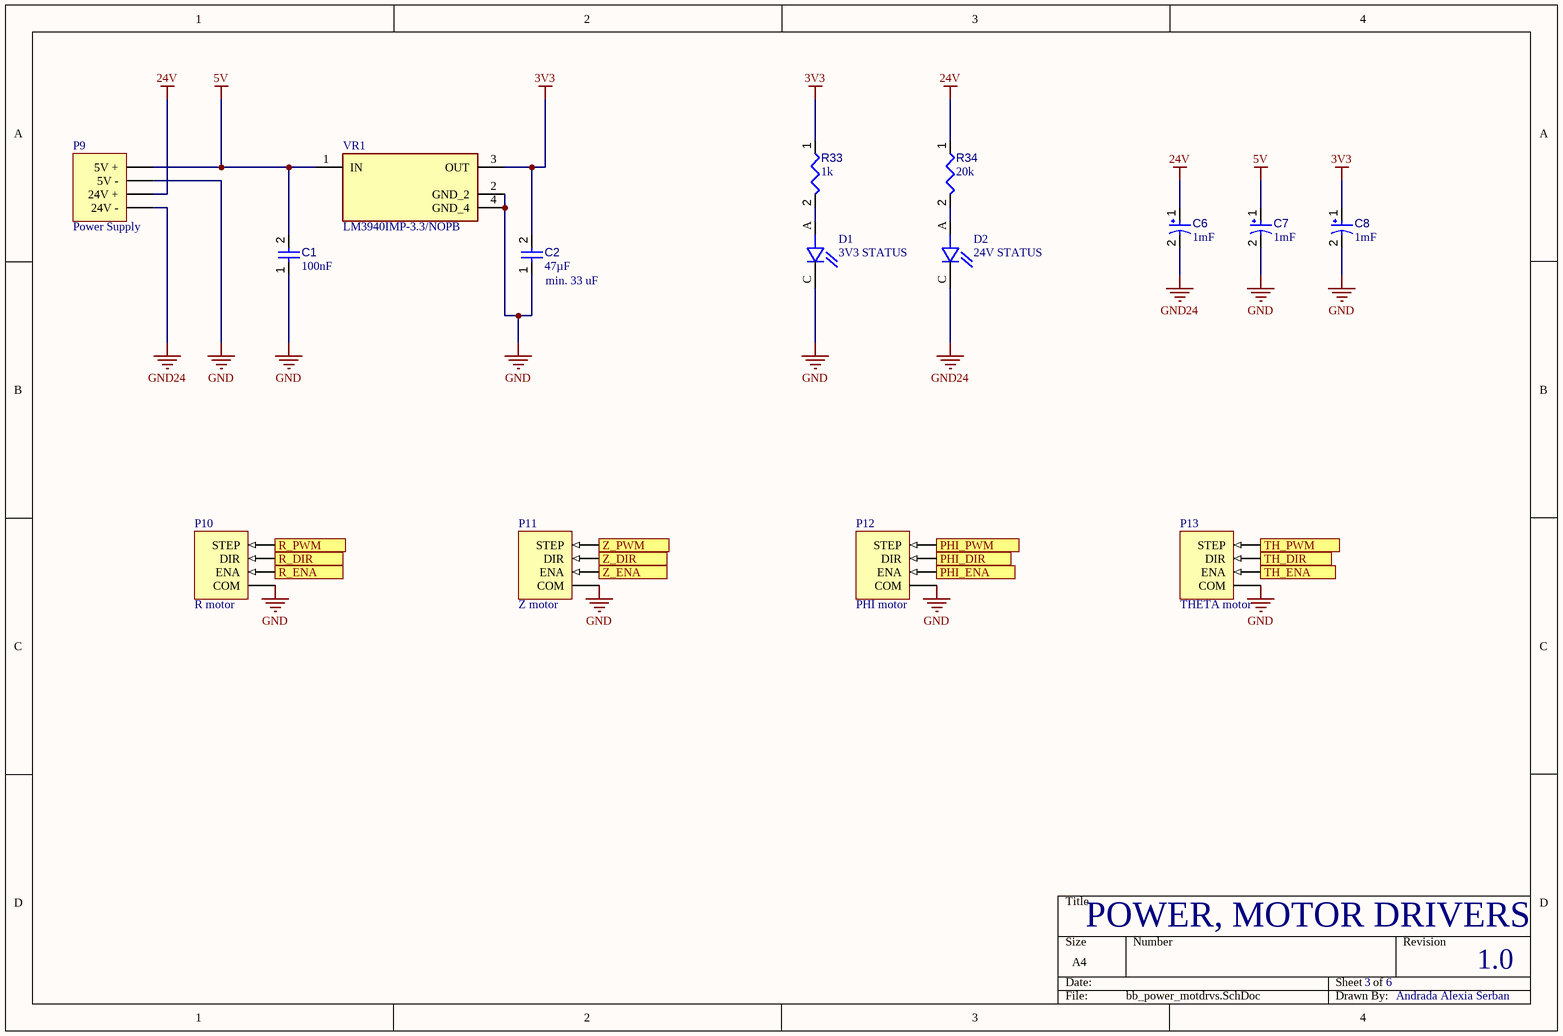
[diagram p2: bb_power_motdrvs.SchDoc]

### Parts
C1  value 100nF  [CAPC2013X145X50ML20T25]  (hidden comment: Capacitor 1 uF +/- 10% 25 V 0805)
C2  value 47µF  [CAPC0805(2012)145_L]  (hidden comment: Capacitor 47µF +/-40% 6.3V 0805)
C6  value 1mF  [CAPPR65-500-2000X1000X2200]  (hidden comment: ECA1EM102)
C7  value 1mF  [CAPPR65-500-2000X1000X2200]  (hidden comment: ECA1EM102)
C8  value 1mF  [CAPPR65-500-2000X1000X2200]  (hidden comment: ECA1EM102)
D1  3V3 STATUS  [LEDC2012X70N]
D2  24V STATUS  [LEDC2012X70N]
P9  Power Supply  [FP_CONN4_STELVIO_MRT9-3,81]
P10  R motor  [FP_CONN4_STELVIO_MRT9-3,81]
P11  Z motor  [FP_CONN4_STELVIO_MRT9-3,81]
P12  PHI motor  [FP_CONN4_STELVIO_MRT9-3,81]
P13  THETA motor  [FP_CONN4_STELVIO_MRT9-3,81]
R33  value 1k  [RESC0402(1005)_L]  (hidden comment: Resistor 200R +/-5 % 0402 63 mW)
R34  value 20k  [RESC0402(1005)_L]  (hidden comment: Resistor 200R +/-5 % 0402 63 mW)
VR1  LM3940IMP-3.3/NOPB  [VREG_LM3940IMP-3.3/NOPB]

### Ports
PHI_DIR (in, see bb_Nucleo[1C]), PHI_ENA (in, see bb_Nucleo[1C]), PHI_PWM (in, see bb_Nucleo[1C]), R_DIR (in, see bb_Nucleo[3B]), R_ENA (in, see bb_Nucleo[3C]), R_PWM (in, see bb_Nucleo[3B]), TH_DIR (in, see bb_Nucleo[4C]), TH_ENA (in, see bb_Nucleo[4C]), TH_PWM (in, see bb_Nucleo[1C]), Z_DIR (in, see bb_Nucleo[3B]), Z_ENA (in, see bb_Nucleo[3B]), Z_PWM (in, see bb_Nucleo[3B])

### Nets
3V3: C2.2 C8.1 R33.1 VR1.3(OUT)
5V: C1.2 C7.1 P9.4(5V_+) VR1.1(IN)
24V: C6.1 P9.2(24V_+) R34.1
GND: C1.1 C2.1 C7.2 C8.2 D1.C P9.3(5V_-) P10.1(COM) P11.1(COM) P12.1(COM) P13.1(COM) VR1.2(GND_2) VR1.4(GND_4)
GND24: C6.2 D2.C P9.1(24V_-)
NetA1_CN11_50: P11.4(STEP) ; port Z_PWM
NetA1_CN11_62: P10.4(STEP) ; port R_PWM
NetA1_CN11_64: P13.2(ENA) ; port TH_ENA
NetA1_CN12_3: P12.4(STEP) ; port PHI_PWM
NetA1_CN12_5: P13.4(STEP) ; port TH_PWM
NetA1_CN12_17: P12.2(ENA) ; port PHI_ENA
NetA1_CN12_27: P12.3(DIR) ; port PHI_DIR
NetA1_CN12_40: P11.2(ENA) ; port Z_ENA
NetA1_CN12_44: P11.3(DIR) ; port Z_DIR
NetA1_CN12_47: P10.3(DIR) ; port R_DIR
NetA1_CN12_49: P10.2(ENA) ; port R_ENA
NetA1_CN12_61: P13.3(DIR) ; port TH_DIR
NetD1_A: D1.A R33.2
NetD2_A: D2.A R34.2

### Notes on the sheet
- (near C2) min. 33 uF
- POWER, MOTOR DRIVERS
- 3
- 6
- 1.0
- Andrada Alexia Serban

### Library data of the parts
C1 = CMP-001-00010-6: as C3 on sheet bb_periferia; RoHS Compliant: True; Pins: 2; Mounting Technology: SM; Max Operating Temperature: 125°C; Min Operating Temperature: -55°C; Tolerance: 10%; Case/Package: 0805
C2 = CMP-001-00082-4: Chip Capacitor, 47µF +/-40%, 6.3V, 0805, Thickness 1.45 mm; Tolerance: 10%; Min Operating Temperature: -55°C; Max Operating Temperature: 85°C; Case/Package: 0805; Pins: 2; Mounting Technology: SMT; Voltage Rating: 6.3V
C6-C8 = CMP-001-00023-8: Aluminum Electrolytic Capacitor, 1000 uF, +/- 20%, 25 V, -40 to 85 degC, 2-Pin THD, RoHS, Bulk; Manufacturer: Panasonic; Ripple Current: 850mA; Voltage Rating: 25V; Lead Pitch: 5mm; Datasheet URL: https://industrial.panasonic.com/cdbs/www-data/pdf/RDF0000/ABA0000C1218.pdf; Packaging: Bulk; Package Reference: CAPPR65-500-2000X1000X2200; Package Description: 2-Pin Radial Lead, Dia 10 mm, Height 22 mm; Diameter: 10mm; Min Operating Temperature: -40°C; Datasheet Version: Rev. 05, 10/2016; RoHS Compliant: True; Capacitor Type: Electrolytic; Tolerance: 20%; Mounting Technology: TH; Manufacturer URL: http://www.panasonic.com/; Max Operating Temperature: 85°C; Package Quantity: 200; Case/Package: Radial
D1 D2 = CMP-030-000000-1: Green 566nm LED Indication - Discrete 2V 0805 _2012 Metric_; MF: Dialight; Digi-Key_Part_Number: 350-2044-1-ND; MP: 5988170107F; Source: SnapEDAsch.SchLib; Package: 0805 Dialight; SnapEDA_Link: https://www.snapeda.com/parts/5988170107F/Dialight/view-part/3077305/?ref=snap; Component Type: Standard; Pin Count: 2; Design Item ID: 5988170107F; Digi-Key_Purchase_URL: https://www.digikey.com/product-detail/en/dialight/5988170107F/350-2044-1-ND/1291348?utm_source=snapeda&utm_medium=aggregator&utm_campaign=symbol; Value: *
P9-P13 = Connector_4pin: 4pin Connector
R33 R34 = CMP-009-00161-3: as R1 on sheet bb_periferia; Min Operating Temperature: -55°C; Case/Package: 0402; Max Operating Temperature: 155°C; Pins: 2
VR1 = CMP-019-000000-1: Đ›Đ¸Đ˝ĐµĐąĐ˝Ń‹Đą ŃŃ‚Đ°Đ±Đ¸Đ»Đ¸Đ·Đ°Ń‚ĐľŃ€ Đ˝Đ°ĐżŃ€ŃŹĐ¶ĐµĐ˝Đ¸ŃŹ IC 1 Output 1A SOT-223-4; MF: National Semiconductor; MP: LM3940IMP33; Value: *; Design Item ID: LM3940IMP-3.3/NOPB; Source: LM3940IMP-3.3_NOPB.SchLib; Price: None; Pin Count: 4; Availability: Unavailable; SnapEDA_Link: https://www.snapeda.com/parts/LM3940IMP33/Texas%20Instruments/view-part/21631/?ref=snap; Package: SOT-223-4 National Semiconductor; Component Type: Standard; Check_prices: https://www.snapeda.com/parts/LM3940IMP33/Texas%20Instruments/view-part/21631/?ref=eda

## Sheet bb_optocouplers.SchDoc
size A4; SheetNumber: 4; SheetTotal: 6
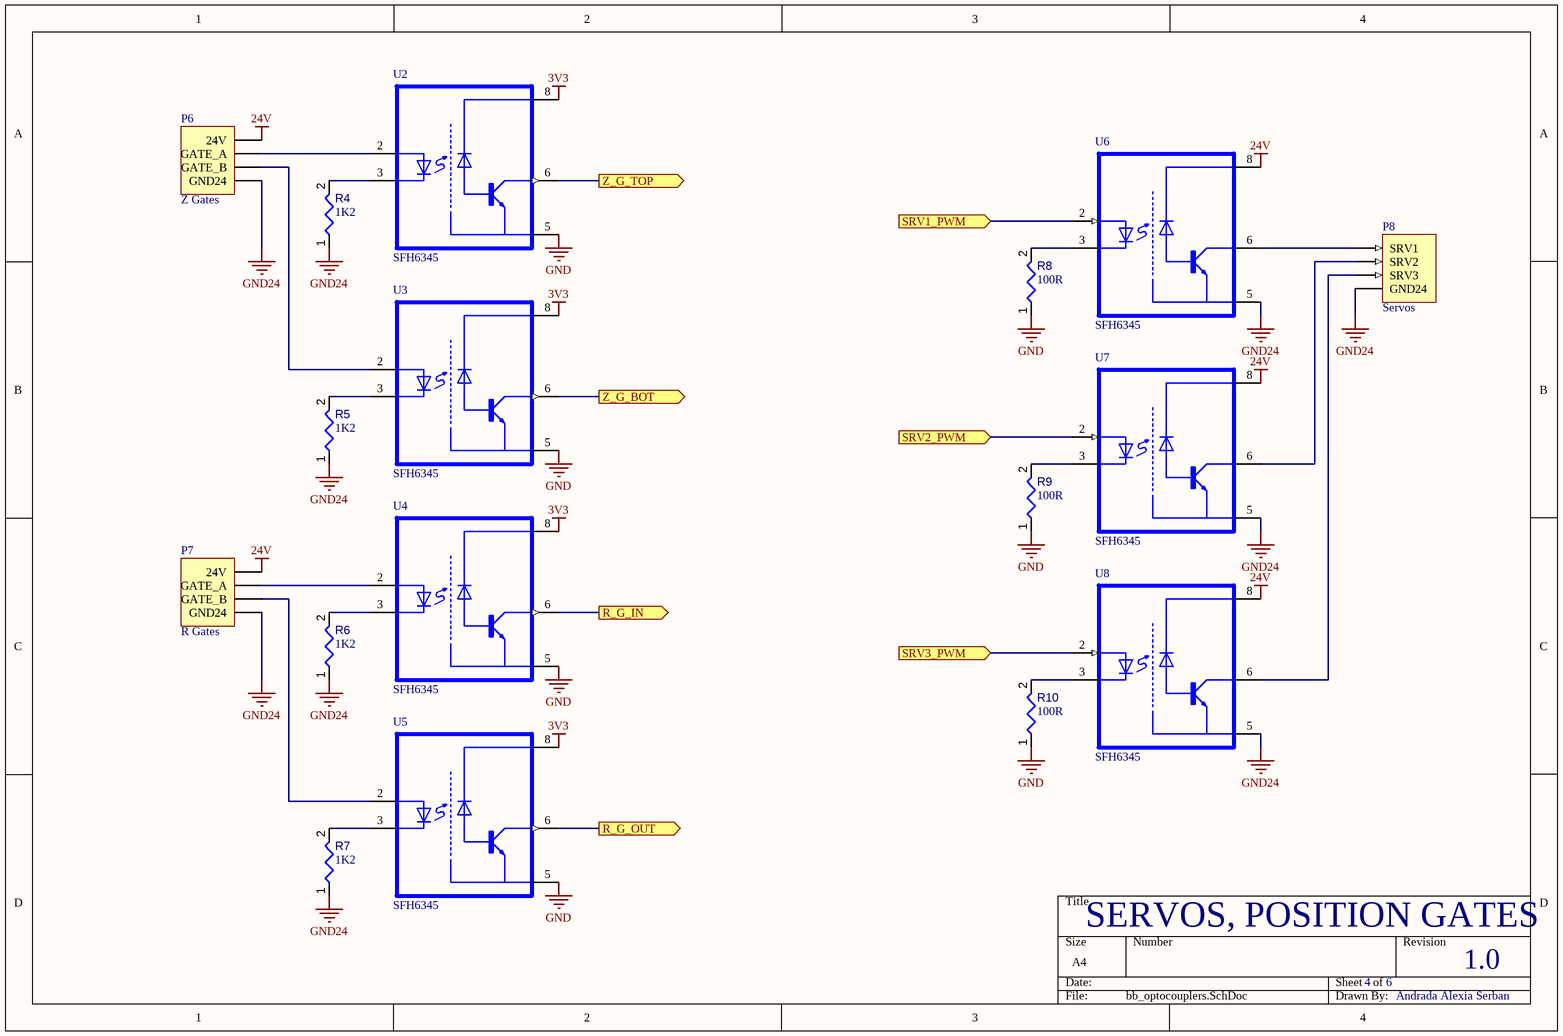
[diagram p3: bb_optocouplers.SchDoc]

### Parts
P6  Z Gates  [FP_CONN4_TAP_254MM]
P7  R Gates  [FP_CONN4_TAP_254MM]
P8  Servos  [FP_CONN4_TAP_254MM]
R4  value 1K2  [RESC0402(1005)_L]  (hidden comment: Resistor 200R +/-5 % 0402 63 mW)
R5  value 1K2  [RESC0402(1005)_L]  (hidden comment: Resistor 200R +/-5 % 0402 63 mW)
R6  value 1K2  [RESC0402(1005)_L]  (hidden comment: Resistor 200R +/-5 % 0402 63 mW)
R7  value 1K2  [RESC0402(1005)_L]  (hidden comment: Resistor 200R +/-5 % 0402 63 mW)
R8  value 100R  [RESC0402(1005)_L]  (hidden comment: Resistor 200R +/-5 % 0402 63 mW)
R9  value 100R  [RESC0402(1005)_L]  (hidden comment: Resistor 200R +/-5 % 0402 63 mW)
R10  value 100R  [RESC0402(1005)_L]  (hidden comment: Resistor 200R +/-5 % 0402 63 mW)
U2  SFH6345  [DIP762W50P254L977H451Q8]
U3  SFH6345  [DIP762W50P254L977H451Q8]
U4  SFH6345  [DIP762W50P254L977H451Q8]
U5  SFH6345  [DIP762W50P254L977H451Q8]
U6  SFH6345  [DIP762W50P254L977H451Q8]
U7  SFH6345  [DIP762W50P254L977H451Q8]
U8  SFH6345  [DIP762W50P254L977H451Q8]

### Ports
R_G_IN (out, see bb_Nucleo[4B]), R_G_OUT (out, see bb_Nucleo[4B]), SRV1_PWM (in, see bb_Nucleo[1A]), SRV2_PWM (in, see bb_Nucleo[1B]), SRV3_PWM (in, see bb_Nucleo[1C]), Z_G_BOT (out, see bb_Nucleo[4B]), Z_G_TOP (out, see bb_Nucleo[4B])

### Nets
3V3: U2.8(VCC) U3.8(VCC) U4.8(VCC) U5.8(VCC)
24V: P6.4(24V) P7.4(24V) U6.8(VCC) U7.8(VCC) U8.8(VCC)
GND: R8.1 R9.1 R10.1 U2.5(E) U3.5(E) U4.5(E) U5.5(E)
GND24: P6.1(GND24) P7.1(GND24) P8.4(GND24) R4.1 R5.1 R6.1 R7.1 U6.5(E) U7.5(E) U8.5(E)
NetA1_CN11_28: U6.2(A) ; port SRV1_PWM
NetA1_CN11_42: U2.6(CO) ; port Z_G_TOP
NetA1_CN11_44: U3.6(CO) ; port Z_G_BOT
NetA1_CN12_25: U8.2(A) ; port SRV3_PWM
NetA1_CN12_37: U7.2(A) ; port SRV2_PWM
NetA1_CN12_68: U5.6(CO) ; port R_G_OUT
NetA1_CN12_69: U4.6(CO) ; port R_G_IN
NetP6_2: P6.2(GATE_B) U3.2(A)
NetP6_3: P6.3(GATE_A) U2.2(A)
NetP7_2: P7.2(GATE_B) U5.2(A)
NetP7_3: P7.3(GATE_A) U4.2(A)
NetP8_1: P8.1(SRV1) U6.6(CO)
NetP8_2: P8.2(SRV2) U7.6(CO)
NetP8_3: P8.3(SRV3) U8.6(CO)
NetR4_2: R4.2 U2.3(C)
NetR5_2: R5.2 U3.3(C)
NetR6_2: R6.2 U4.3(C)
NetR7_2: R7.2 U5.3(C)
NetR8_2: R8.2 U6.3(C)
NetR9_2: R9.2 U7.3(C)
NetR10_2: R10.2 U8.3(C)

### Notes on the sheet
- SERVOS, POSITION GATES
- 4
- 6
- 1.0
- Andrada Alexia Serban

### Library data of the parts
P6-P8 = Connector_4pin: 4pin Connector
R4-R10 = CMP-009-00161-3: as R1 on sheet bb_periferia; Min Operating Temperature: -55°C; Case/Package: 0402; Max Operating Temperature: 155°C; Pins: 2
U2-U8 = CMP-013-000000-1: Analog High Speed Coupler, High Noise Immunity, 1 MBd, 15 kV/ÎĽs; Pin Count: 5; Source: SFH6345.SchLib; MP: SFH6345; Design Item ID: SFH6345; Price: None; Availability: Unavailable; Component Type: Standard; Package: None; Value: *

## Sheet bb_optocouplers2.SchDoc
size A4; SheetNumber: 5; SheetTotal: 6
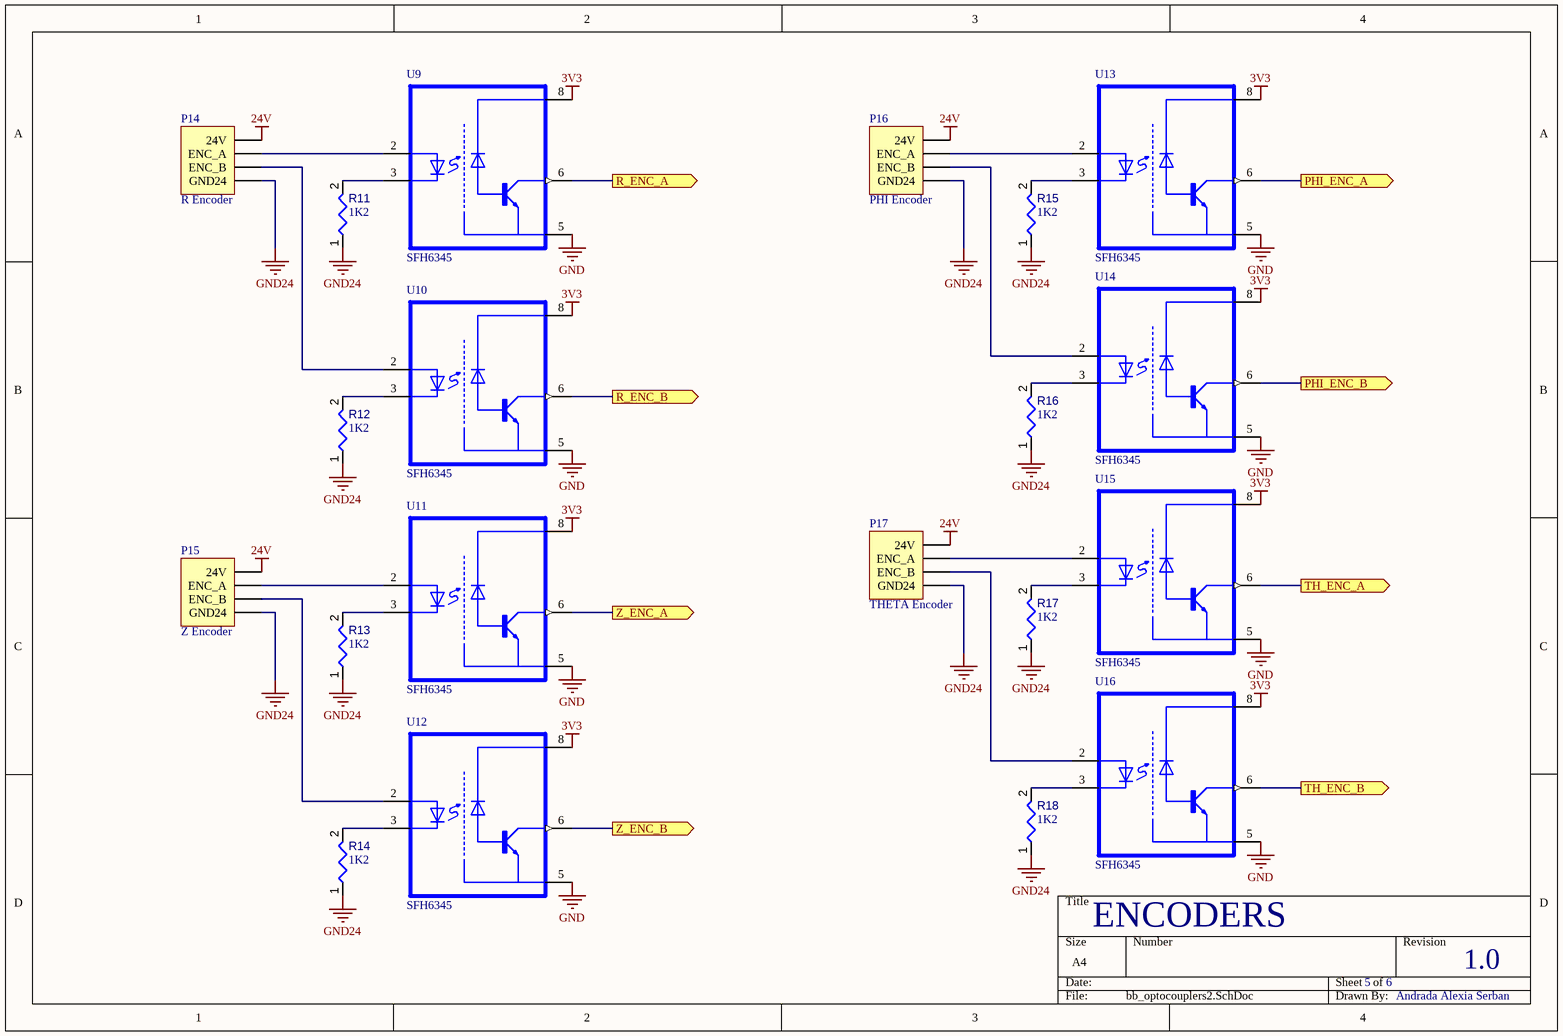
[diagram p4: bb_optocouplers2.SchDoc]

### Parts
P14  R Encoder  [FP_CONN4_TAP_254MM]
P15  Z Encoder  [FP_CONN4_TAP_254MM]
P16  PHI Encoder  [FP_CONN4_TAP_254MM]
P17  THETA Encoder  [FP_CONN4_TAP_254MM]
R11  value 1K2  [RESC0402(1005)_L]  (hidden comment: Resistor 200R +/-5 % 0402 63 mW)
R12  value 1K2  [RESC0402(1005)_L]  (hidden comment: Resistor 200R +/-5 % 0402 63 mW)
R13  value 1K2  [RESC0402(1005)_L]  (hidden comment: Resistor 200R +/-5 % 0402 63 mW)
R14  value 1K2  [RESC0402(1005)_L]  (hidden comment: Resistor 200R +/-5 % 0402 63 mW)
R15  value 1K2  [RESC0402(1005)_L]  (hidden comment: Resistor 200R +/-5 % 0402 63 mW)
R16  value 1K2  [RESC0402(1005)_L]  (hidden comment: Resistor 200R +/-5 % 0402 63 mW)
R17  value 1K2  [RESC0402(1005)_L]  (hidden comment: Resistor 200R +/-5 % 0402 63 mW)
R18  value 1K2  [RESC0402(1005)_L]  (hidden comment: Resistor 200R +/-5 % 0402 63 mW)
U9  SFH6345  [DIP762W50P254L977H451Q8]
U10  SFH6345  [DIP762W50P254L977H451Q8]
U11  SFH6345  [DIP762W50P254L977H451Q8]
U12  SFH6345  [DIP762W50P254L977H451Q8]
U13  SFH6345  [DIP762W50P254L977H451Q8]
U14  SFH6345  [DIP762W50P254L977H451Q8]
U15  SFH6345  [DIP762W50P254L977H451Q8]
U16  SFH6345  [DIP762W50P254L977H451Q8]

### Ports
PHI_ENC_A (out, see bb_Nucleo[3B]), PHI_ENC_B (out, see bb_Nucleo[3C]), R_ENC_A (out, see bb_Nucleo[3B]), R_ENC_B (out, see bb_Nucleo[3B]), TH_ENC_A (out, see bb_Nucleo[2B]), TH_ENC_B (out, see bb_Nucleo[2B]), Z_ENC_A (out, see bb_Nucleo[1B]), Z_ENC_B (out, see bb_Nucleo[1C])

### Nets
3V3: U9.8(VCC) U10.8(VCC) U11.8(VCC) U12.8(VCC) U13.8(VCC) U14.8(VCC) U15.8(VCC) U16.8(VCC)
24V: P14.4(24V) P15.4(24V) P16.4(24V) P17.4(24V)
GND: U9.5(E) U10.5(E) U11.5(E) U12.5(E) U13.5(E) U14.5(E) U15.5(E) U16.5(E)
GND24: P14.1(GND24) P15.1(GND24) P16.1(GND24) P17.1(GND24) R11.1 R12.1 R13.1 R14.1 R15.1 R16.1 R17.1 R18.1
NetA1_CN12_4: U15.6(CO) ; port TH_ENC_A
NetA1_CN12_13: U11.6(CO) ; port Z_ENC_A
NetA1_CN12_19: U16.6(CO) ; port TH_ENC_B
NetA1_CN12_29: U12.6(CO) ; port Z_ENC_B
NetA1_CN12_41: U10.6(CO) ; port R_ENC_B
NetA1_CN12_43: U9.6(CO) ; port R_ENC_A
NetA1_CN12_52: U13.6(CO) ; port PHI_ENC_A
NetA1_CN12_56: U14.6(CO) ; port PHI_ENC_B
NetP14_2: P14.2(ENC_B) U10.2(A)
NetP14_3: P14.3(ENC_A) U9.2(A)
NetP15_2: P15.2(ENC_B) U12.2(A)
NetP15_3: P15.3(ENC_A) U11.2(A)
NetP16_2: P16.2(ENC_B) U14.2(A)
NetP16_3: P16.3(ENC_A) U13.2(A)
NetP17_2: P17.2(ENC_B) U16.2(A)
NetP17_3: P17.3(ENC_A) U15.2(A)
NetR11_2: R11.2 U9.3(C)
NetR12_2: R12.2 U10.3(C)
NetR13_2: R13.2 U11.3(C)
NetR14_2: R14.2 U12.3(C)
NetR15_2: R15.2 U13.3(C)
NetR16_2: R16.2 U14.3(C)
NetR17_2: R17.2 U15.3(C)
NetR18_2: R18.2 U16.3(C)

### Notes on the sheet
- ENCODERS
- 5
- 6
- 1.0
- Andrada Alexia Serban

### Library data of the parts
P14-P17 = Connector_4pin: 4pin Connector
R11-R18 = CMP-009-00161-3: as R1 on sheet bb_periferia; Min Operating Temperature: -55°C; Case/Package: 0402; Max Operating Temperature: 155°C; Pins: 2
U9-U16 = CMP-013-000000-1: as U2 on sheet bb_optocouplers; Pin Count: 5; Source: SFH6345.SchLib; MP: SFH6345; Design Item ID: SFH6345; Price: None; Availability: Unavailable; Component Type: Standard; Package: None; Value: *

## Sheet bb_optocouplers3.SchDoc
size A4; SheetNumber: 6; SheetTotal: 6
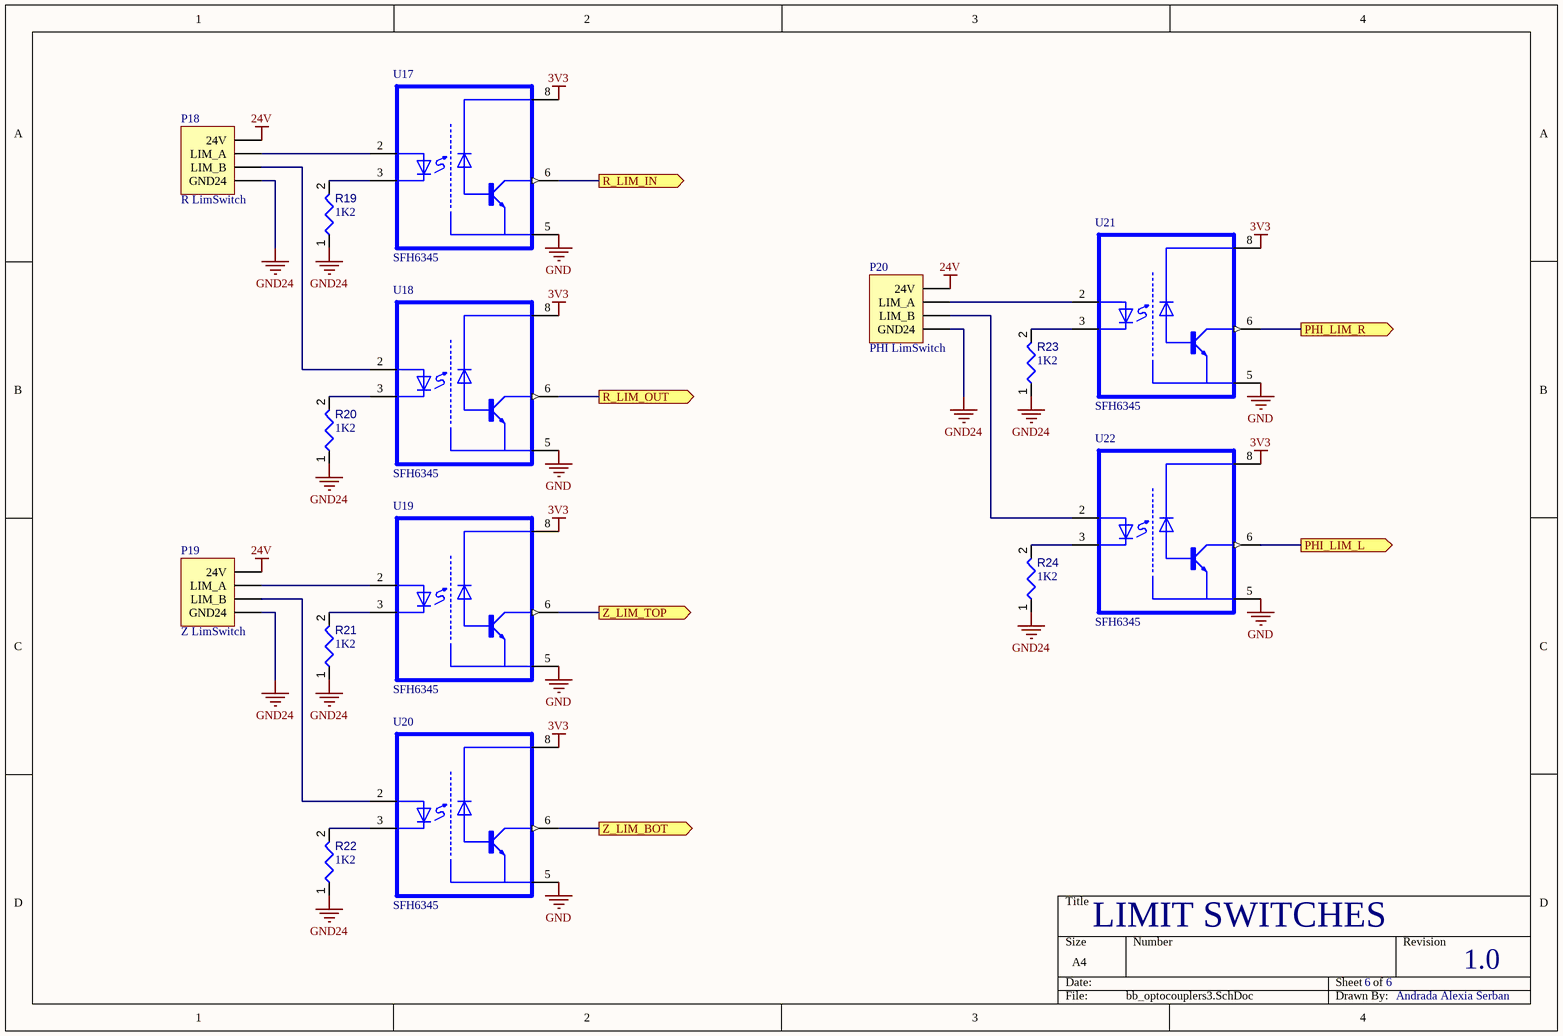
[diagram p5: bb_optocouplers3.SchDoc]

### Parts
P18  R LimSwitch  [FP_CONN4_TAP_254MM]
P19  Z LimSwitch  [FP_CONN4_TAP_254MM]
P20  PHI LimSwitch  [FP_CONN4_TAP_254MM]
R19  value 1K2  [RESC0402(1005)_L]  (hidden comment: Resistor 200R +/-5 % 0402 63 mW)
R20  value 1K2  [RESC0402(1005)_L]  (hidden comment: Resistor 200R +/-5 % 0402 63 mW)
R21  value 1K2  [RESC0402(1005)_L]  (hidden comment: Resistor 200R +/-5 % 0402 63 mW)
R22  value 1K2  [RESC0402(1005)_L]  (hidden comment: Resistor 200R +/-5 % 0402 63 mW)
R23  value 1K2  [RESC0402(1005)_L]  (hidden comment: Resistor 200R +/-5 % 0402 63 mW)
R24  value 1K2  [RESC0402(1005)_L]  (hidden comment: Resistor 200R +/-5 % 0402 63 mW)
U17  SFH6345  [DIP762W50P254L977H451Q8]
U18  SFH6345  [DIP762W50P254L977H451Q8]
U19  SFH6345  [DIP762W50P254L977H451Q8]
U20  SFH6345  [DIP762W50P254L977H451Q8]
U21  SFH6345  [DIP762W50P254L977H451Q8]
U22  SFH6345  [DIP762W50P254L977H451Q8]

### Ports
PHI_LIM_L (out, see bb_Nucleo[3A]), PHI_LIM_R (out, see bb_Nucleo[3A]), R_LIM_IN (out, see bb_Nucleo[3A]), R_LIM_OUT (out, see bb_Nucleo[3A]), Z_LIM_BOT (out, see bb_Nucleo[3A]), Z_LIM_TOP (out, see bb_Nucleo[3A])

### Nets
3V3: U17.8(VCC) U18.8(VCC) U19.8(VCC) U20.8(VCC) U21.8(VCC) U22.8(VCC)
24V: P18.4(24V) P19.4(24V) P20.4(24V)
GND: U17.5(E) U18.5(E) U19.5(E) U20.5(E) U21.5(E) U22.5(E)
GND24: P18.1(GND24) P19.1(GND24) P20.1(GND24) R19.1 R20.1 R21.1 R22.1 R23.1 R24.1
NetA1_CN11_39: U20.6(CO) ; port Z_LIM_BOT
NetA1_CN11_40: U19.6(CO) ; port Z_LIM_TOP
NetA1_CN11_41: U17.6(CO) ; port R_LIM_IN
NetA1_CN11_43: U18.6(CO) ; port R_LIM_OUT
NetA1_CN11_55: U22.6(CO) ; port PHI_LIM_L
NetA1_CN11_57: U21.6(CO) ; port PHI_LIM_R
NetP18_2: P18.2(LIM_B) U18.2(A)
NetP18_3: P18.3(LIM_A) U17.2(A)
NetP19_2: P19.2(LIM_B) U20.2(A)
NetP19_3: P19.3(LIM_A) U19.2(A)
NetP20_2: P20.2(LIM_B) U22.2(A)
NetP20_3: P20.3(LIM_A) U21.2(A)
NetR19_2: R19.2 U17.3(C)
NetR20_2: R20.2 U18.3(C)
NetR21_2: R21.2 U19.3(C)
NetR22_2: R22.2 U20.3(C)
NetR23_2: R23.2 U21.3(C)
NetR24_2: R24.2 U22.3(C)

### Notes on the sheet
- LIMIT SWITCHES
- 6
- 1.0
- Andrada Alexia Serban

### Library data of the parts
P18-P20 = Connector_4pin: 4pin Connector
R19-R24 = CMP-009-00161-3: as R1 on sheet bb_periferia; Min Operating Temperature: -55°C; Case/Package: 0402; Max Operating Temperature: 155°C; Pins: 2
U17-U22 = CMP-013-000000-1: as U2 on sheet bb_optocouplers; Pin Count: 5; Source: SFH6345.SchLib; MP: SFH6345; Design Item ID: SFH6345; Price: None; Availability: Unavailable; Component Type: Standard; Package: None; Value: *

## Nets that join several sheets
3V3: bb_Nucleo (A1.CN11_16 A1.CN12_7), bb_periferia (5 pins), bb_power_motdrvs (C2.2 C8.1 R33.1 VR1.3), bb_optocouplers (U2.8 U3.8 U4.8 U5.8), bb_optocouplers2 (8 pins), bb_optocouplers3 (6 pins)
5V: bb_Nucleo (A1.CN11_5 A1.CN11_18 A1.CN12_8), bb_periferia (11 pins), bb_power_motdrvs (C1.2 C7.1 P9.4 VR1.1)
24V: bb_periferia (P1.1), bb_power_motdrvs (C6.1 P9.2 R34.1), bb_optocouplers (5 pins), bb_optocouplers2 (P14.4 P15.4 P16.4 P17.4), bb_optocouplers3 (P18.4 P19.4 P20.4)
GND: bb_Nucleo (16 pins), bb_periferia (28 pins), bb_power_motdrvs (12 pins), bb_optocouplers (7 pins), bb_optocouplers2 (8 pins), bb_optocouplers3 (6 pins)
GND24: bb_periferia (Q1.2), bb_power_motdrvs (C6.2 D2.C P9.1), bb_optocouplers (10 pins), bb_optocouplers2 (12 pins), bb_optocouplers3 (9 pins)
NetA1_CN11_1: bb_Nucleo (A1.CN11_1), bb_periferia (P5.5)
NetA1_CN11_2: bb_Nucleo (A1.CN11_2), bb_periferia (P5.4)
NetA1_CN11_3: bb_Nucleo (A1.CN11_3), bb_periferia (U23.3)
NetA1_CN11_4: bb_Nucleo (A1.CN11_4), bb_periferia (U23.2)
NetA1_CN11_9: bb_Nucleo (A1.CN11_9), bb_periferia (U1.5)
NetA1_CN11_11: bb_Nucleo (A1.CN11_11), bb_periferia (U1.6)
NetA1_CN11_17: bb_Nucleo (A1.CN11_17), bb_periferia (J2.01)
NetA1_CN11_28: bb_Nucleo (A1.CN11_28), bb_optocouplers (U6.2)
NetA1_CN11_32: bb_Nucleo (A1.CN11_32), bb_periferia (P5.2)
NetA1_CN11_35: bb_Nucleo (A1.CN11_35), bb_periferia (J2.05)
NetA1_CN11_37: bb_Nucleo (A1.CN11_37), bb_periferia (J2.04)
NetA1_CN11_38: bb_Nucleo (A1.CN11_38), bb_periferia (J3.2)
NetA1_CN11_39: bb_Nucleo (A1.CN11_39), bb_optocouplers3 (U20.6)
NetA1_CN11_40: bb_Nucleo (A1.CN11_40), bb_optocouplers3 (U19.6)
NetA1_CN11_41: bb_Nucleo (A1.CN11_41), bb_optocouplers3 (U17.6)
NetA1_CN11_42: bb_Nucleo (A1.CN11_42), bb_optocouplers (U2.6)
NetA1_CN11_43: bb_Nucleo (A1.CN11_43), bb_optocouplers3 (U18.6)
NetA1_CN11_44: bb_Nucleo (A1.CN11_44), bb_optocouplers (U3.6)
NetA1_CN11_45: bb_Nucleo (A1.CN11_45), bb_periferia (J3.3)
NetA1_CN11_46: bb_Nucleo (A1.CN11_46), bb_periferia (J18.3)
NetA1_CN11_47: bb_Nucleo (A1.CN11_47), bb_periferia (J18.5)
NetA1_CN11_48: bb_Nucleo (A1.CN11_48), bb_periferia (J3.4)
NetA1_CN11_50: bb_Nucleo (A1.CN11_50), bb_power_motdrvs (P11.4)
NetA1_CN11_51: bb_Nucleo (A1.CN11_51), bb_periferia (P2.3)
NetA1_CN11_52: bb_Nucleo (A1.CN11_52), bb_periferia (J3.6)
NetA1_CN11_53: bb_Nucleo (A1.CN11_53), bb_periferia (P2.2)
NetA1_CN11_55: bb_Nucleo (A1.CN11_55), bb_optocouplers3 (U22.6)
NetA1_CN11_57: bb_Nucleo (A1.CN11_57), bb_optocouplers3 (U21.6)
NetA1_CN11_58: bb_Nucleo (A1.CN11_58), bb_periferia (P4.1)
NetA1_CN11_59: bb_Nucleo (A1.CN11_59), bb_periferia (P3.1)
NetA1_CN11_61: bb_Nucleo (A1.CN11_61), bb_periferia (J18.8)
NetA1_CN11_62: bb_Nucleo (A1.CN11_62), bb_power_motdrvs (P10.4)
NetA1_CN11_63: bb_Nucleo (A1.CN11_63), bb_periferia (J4.4)
NetA1_CN11_64: bb_Nucleo (A1.CN11_64), bb_power_motdrvs (P13.2)
NetA1_CN11_65: bb_Nucleo (A1.CN11_65), bb_periferia (J4.6)
NetA1_CN11_66: bb_Nucleo (A1.CN11_66), bb_periferia (J4.5)
NetA1_CN12_1: bb_Nucleo (A1.CN12_1), bb_periferia (J2.15)
NetA1_CN12_2: bb_Nucleo (A1.CN12_2), bb_periferia (J2.14)
NetA1_CN12_3: bb_Nucleo (A1.CN12_3), bb_power_motdrvs (P12.4)
NetA1_CN12_4: bb_Nucleo (A1.CN12_4), bb_optocouplers2 (U15.6)
NetA1_CN12_5: bb_Nucleo (A1.CN12_5), bb_power_motdrvs (P13.4)
NetA1_CN12_11: bb_Nucleo (A1.CN12_11), bb_periferia (J2.02)
NetA1_CN12_13: bb_Nucleo (A1.CN12_13), bb_optocouplers2 (U11.6)
NetA1_CN12_16: bb_Nucleo (A1.CN12_16), bb_periferia (J2.08)
NetA1_CN12_17: bb_Nucleo (A1.CN12_17), bb_power_motdrvs (P12.2)
NetA1_CN12_18: bb_Nucleo (A1.CN12_18), bb_periferia (J2.11)
NetA1_CN12_19: bb_Nucleo (A1.CN12_19), bb_optocouplers2 (U16.6)
NetA1_CN12_22: bb_Nucleo (A1.CN12_22), bb_periferia (P5.3)
NetA1_CN12_24: bb_Nucleo (A1.CN12_24), bb_periferia (J2.10)
NetA1_CN12_25: bb_Nucleo (A1.CN12_25), bb_optocouplers (U8.2)
NetA1_CN12_26: bb_Nucleo (A1.CN12_26), bb_periferia (J2.07)
NetA1_CN12_27: bb_Nucleo (A1.CN12_27), bb_power_motdrvs (P12.3)
NetA1_CN12_29: bb_Nucleo (A1.CN12_29), bb_optocouplers2 (U12.6)
NetA1_CN12_36: bb_Nucleo (A1.CN12_36), bb_periferia (U1.4)
NetA1_CN12_37: bb_Nucleo (A1.CN12_37), bb_optocouplers (U7.2)
NetA1_CN12_38: bb_Nucleo (A1.CN12_38), bb_periferia (J4.7)
NetA1_CN12_40: bb_Nucleo (A1.CN12_40), bb_power_motdrvs (P11.2)
NetA1_CN12_41: bb_Nucleo (A1.CN12_41), bb_optocouplers2 (U10.6)
NetA1_CN12_43: bb_Nucleo (A1.CN12_43), bb_optocouplers2 (U9.6)
NetA1_CN12_44: bb_Nucleo (A1.CN12_44), bb_power_motdrvs (P11.3)
NetA1_CN12_45: bb_Nucleo (A1.CN12_45), bb_periferia (J2.18)
NetA1_CN12_46: bb_Nucleo (A1.CN12_46), bb_periferia (J2.20)
NetA1_CN12_47: bb_Nucleo (A1.CN12_47), bb_power_motdrvs (P10.3)
NetA1_CN12_48: bb_Nucleo (A1.CN12_48), bb_periferia (J2.21)
NetA1_CN12_49: bb_Nucleo (A1.CN12_49), bb_power_motdrvs (P10.2)
NetA1_CN12_51: bb_Nucleo (A1.CN12_51), bb_periferia (Q2.1 R2.1)
NetA1_CN12_52: bb_Nucleo (A1.CN12_52), bb_optocouplers2 (U13.6)
NetA1_CN12_53: bb_Nucleo (A1.CN12_53), bb_periferia (J3.5)
NetA1_CN12_55: bb_Nucleo (A1.CN12_55), bb_periferia (R1.2)
NetA1_CN12_56: bb_Nucleo (A1.CN12_56), bb_optocouplers2 (U14.6)
NetA1_CN12_58: bb_Nucleo (A1.CN12_58), bb_periferia (J3.7)
NetA1_CN12_61: bb_Nucleo (A1.CN12_61), bb_power_motdrvs (P13.3)
NetA1_CN12_64: bb_Nucleo (A1.CN12_64), bb_periferia (J18.1)
NetA1_CN12_65: bb_Nucleo (A1.CN12_65), bb_periferia (J2.17)
NetA1_CN12_66: bb_Nucleo (A1.CN12_66), bb_periferia (J4.3)
NetA1_CN12_68: bb_Nucleo (A1.CN12_68), bb_optocouplers (U5.6)
NetA1_CN12_69: bb_Nucleo (A1.CN12_69), bb_optocouplers (U4.6)
NetA1_CN12_70: bb_Nucleo (A1.CN12_70), bb_periferia (J4.2)